# EAGLE design hyundai_i (EAGLE 9.6.2)
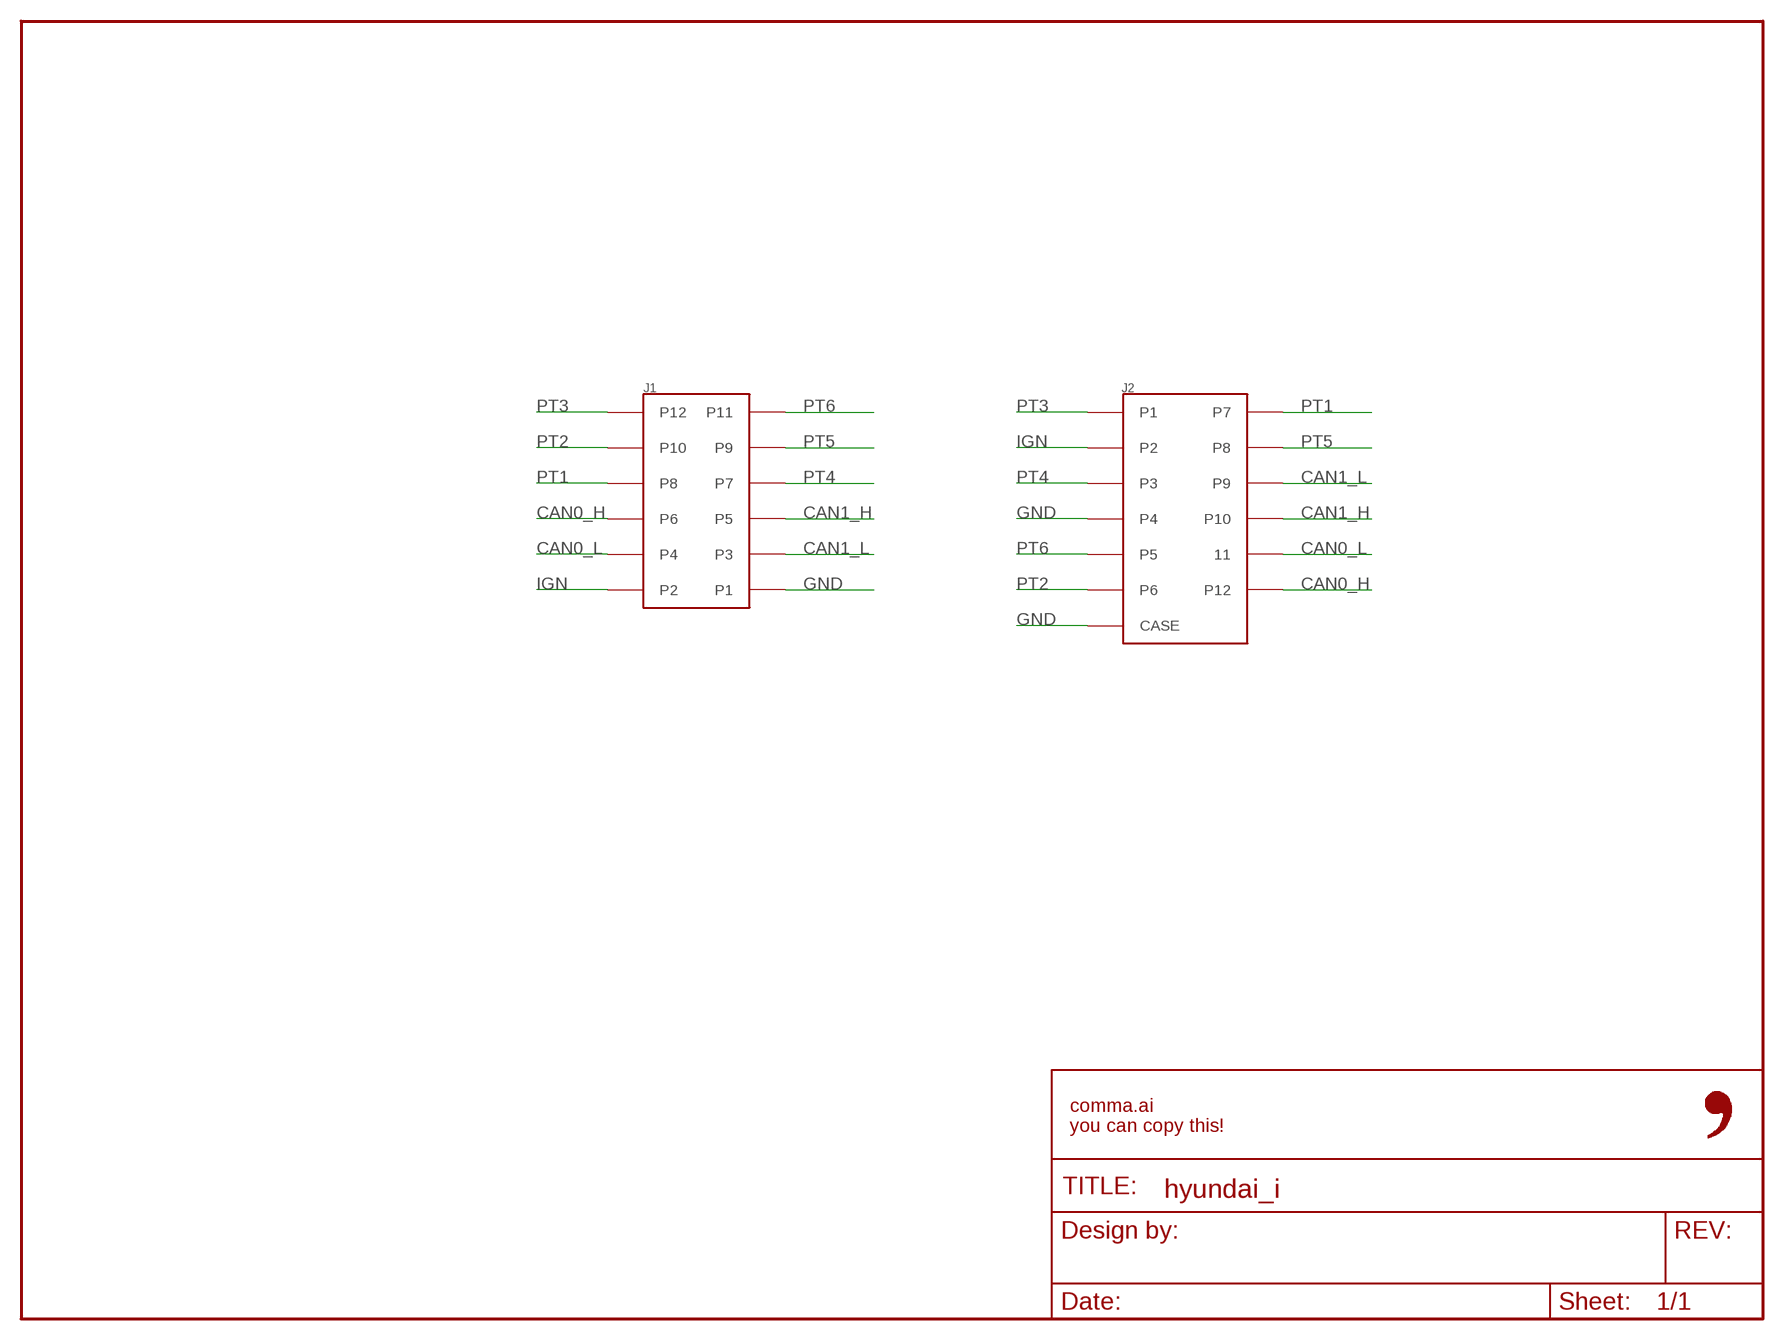
[diagram p0: schematic, sheet 1]

## Parts
FRAME1  FRAME-LETTER-OPENNO_PACKAGE  [DUMMY]
J1  5018761240  [5018761240]
J2  MG645845  [MG645845]

## Nets
CAN0_H: J1.P6 J2.P12
CAN0_L: J1.P4 J2.P11
CAN1_H: J1.P5 J2.P10
CAN1_L: J1.P3 J2.P9
GND: J1.P1 J2.P4 J2.P$1(CASE) J2.P$2(CASE)
IGN: J1.P2 J2.P2
PT1: J1.P8 J2.P7
PT2: J1.P10 J2.P6
PT3: J1.P12 J2.P1
PT4: J1.P7 J2.P3
PT5: J1.P9 J2.P8
PT6: J1.P11 J2.P5

## Library data of the parts
FRAME1 = comma.ai:FRAME-LETTER-OPEN: Schematic Frame - Letter Standard 8.5x11 US Letter frame; DESIGNER: Nobody; VERSION: v01
J1 = comma.ai:5018761240; CPN: CAI-HARNESS-MOLEX-5018761240
J2 = comma.ai:MG645845; CPN: CAI-HARNESS-KET-MG645982-4

## Board
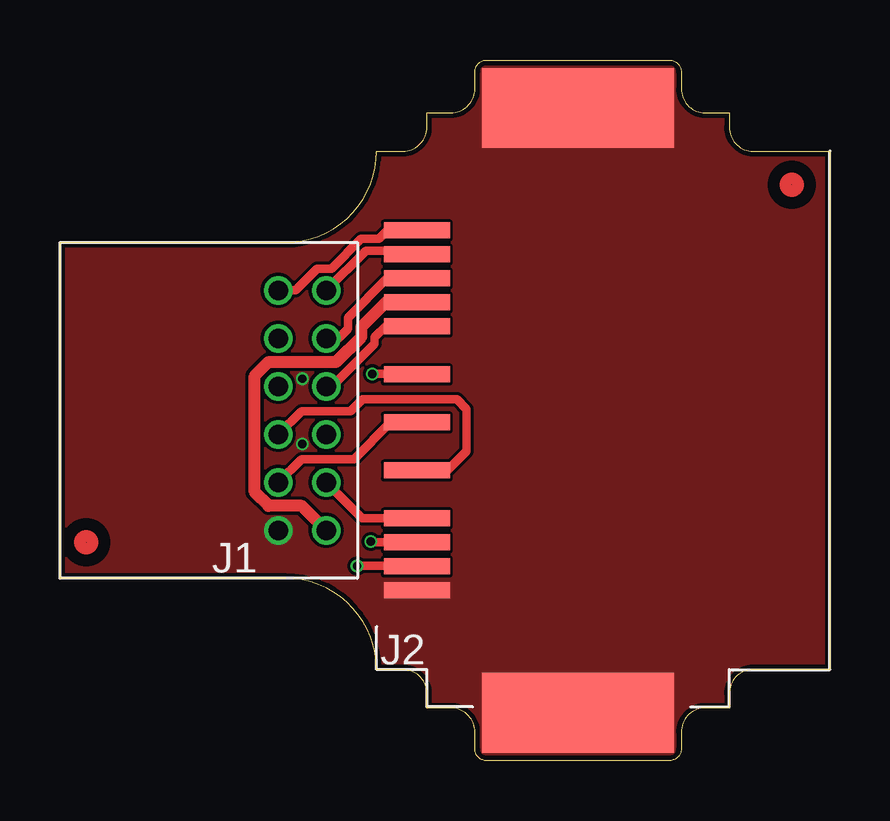
[diagram p1: board, top side]
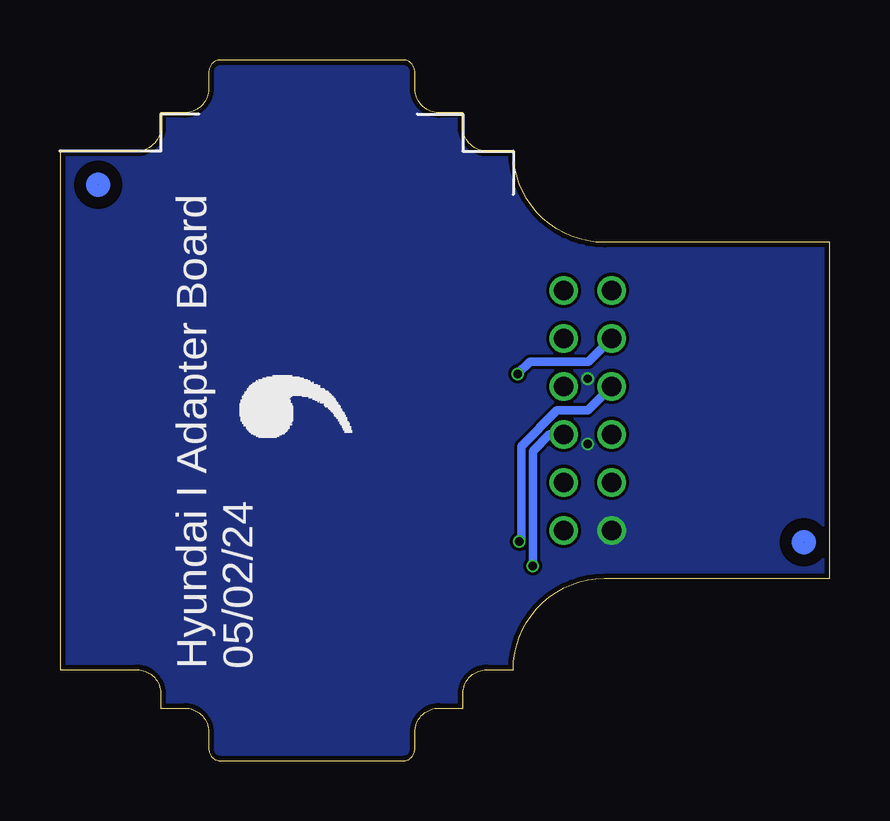
[diagram p2: board, bottom side, seen from below]

Size 32.1 x 29.2 mm. Coordinates in mm from the lower left corner, seen from the top.
Outline: 0,21.6 9.4,21.6 arc90 13.2,25.4 14.3,25.4 arc90 15.3,26.4 15.3,27 16.3,27 arc90 17.3,28 17.3,28.7 arc-90 17.8,29.2 25.4,29.2 arc-90 25.9,28.7 25.9,28 arc90 26.9,27 27.9,27 27.9,26.4 arc90 28.9,25.4 32.1,25.4 32.1,3.8 28.9,3.8 arc90 27.9,2.8 27.9,2.2 26.9,2.2 arc90 25.9,1.2 25.9,0.5 arc-90 25.4,0 17.8,0 arc-90 17.3,0.5 17.3,1.2 arc90 16.3,2.2 15.3,2.2 15.3,2.8 arc90 14.3,3.8 13.2,3.8 arc90 9.4,7.6 0,7.6 0,21.6
Copper layers (1*16): Top 0.035mm / dielectric 1.5mm / Bottom 0.035mm
Design rules "jlcpcb_2layer": minimum track width 5mil, minimum drill 12mil, track to track 5mil, track to pad 5mil, pad to pad 5mil, via to via 5mil, smd to smd 5mil, copper to edge 8mil, drill to drill 8mil, minimum pad ring 3mil, minimum via ring 3mil, stop-mask expansion 4mm, vias tented up to drill 20mil, thermal gap 10mil

### Footprints (pad centres in the part's own frame; a part is rotated, then mirrored left to right if it is on the bottom)
5018761240 = drill 0.8: P1 5,-1; P2 5,1; P3 3,-1; P4 3,1; P5 1,-1; P6 1,1; P7 -1,-1; P8 -1,1; P9 -3,-1; P10 -3,1; P11 -5,-1; P12 -5,1
MG645845 = smd 0.66 x 2.75: P1 6.5,6.72; P2 4.5,6.72; P3 -5.5,6.72; P4 -7.5,6.72; P5 7.5,6.72; P6 5.5,6.72; P7 3.5,6.72; P8 1.5,6.72; P9 -0.5,6.72; P10 -2.5,6.72; P11 -4.5,6.72; P12 -6.5,6.72 | smd 3.32 x 8: P$1 -12.6,0; P$2 12.6,0

### Placement (x,y rotation side)
FRAME1  1.21,-0.64 0 top
J1  10.1,14.6 270 top
J2  21.6,14.6 90 top
U$1  [LOGO]  19.62,12.79 90 bottom
U$2  [FIDUCIAL]  30.5,24 0 top
U$3  [FIDUCIAL]  1.1,9.1 0 top

### Tracks (layer width: path | path; a pad name or v marks a point on that pad's centre or on a via)
CAN0_H  (via drill 0.35)
  Top 0.356: v12.39,8.12 14.86,8.12 J2.P12
  Bottom 0.356: J1.P6 11.68,13.6 12.39,12.9 v12.39,8.12
CAN0_L
  Top 0.356: J1.P4 12.6,10.1 J2.P11
CAN1_H
  Top 0.356: J2.P10 16.16,12.1 16.96,12.9 16.96,14.65 16.54,15.06 12.61,15.06 12.11,14.57 10.07,14.57 J1.P5
CAN1_L
  Top 0.356: J1.P3 10.07,12.57 12.26,12.57 13.79,14.1 J2.P9
GND  (via drill 0.35)
  other vias: 10.1,13.2 10.1,15.92
  pour Top (no thermals): -1.9,30.6 34.1,30.6 34.1,-1.4 -1.9,-1.4
  pour Bottom (no thermals): -2.9,31.6 35.1,31.6 35.1,-2.4 -2.9,-2.4
IGN
  Top 0.508: J1.P2 10.08,10.62 8.69,10.62 8.12,11.19 8.12,16.04 8.7,16.62 11.51,16.62 12.56,17.68 12.56,18.08 13.58,19.1 J2.P2
PT1
  Top 0.356: J1.P8 11.35,15.6 13.12,17.37 13.12,17.65 13.63,18.16 14.82,18.16 J2.P7
PT2
  Top 0.356: J1.P10 11.61,17.6 12,18 12,18.46 13.64,20.1 J2.P6
PT3
  Top 0.356: J1.P12 12.75,21.25 13.66,21.25 13.81,21.1 J2.P1
PT4  (via drill 0.35)
  Top 0.356: J2.P3 12.99,9.1 v12.95,9.14
  Bottom 0.356: v12.95,9.14 12.87,9.22 12.87,13.11 11.38,14.6 10.1,14.6 J1.P7
PT5  (via drill 0.35)
  Top 0.356: v13.02,16.12 14.86,16.12 J2.P8
  Bottom 0.356: J1.P9 10.07,16.63 12.51,16.63 v13.02,16.12
PT6
  Top 0.356: J2.P5 13.66,22.1 13.3,21.74 12.56,21.74 11.32,20.5 10.72,20.5 9.82,19.6 J1.P11

### Text on the board
bNames: Hyundai I Adapter Board / 05/02/24